# Altium schematic sheet MIPI CSI 0 and 1 Connectors.SchDoc
size 420 x 297 mm; SheetNumber: 21; SheetTotal: 26
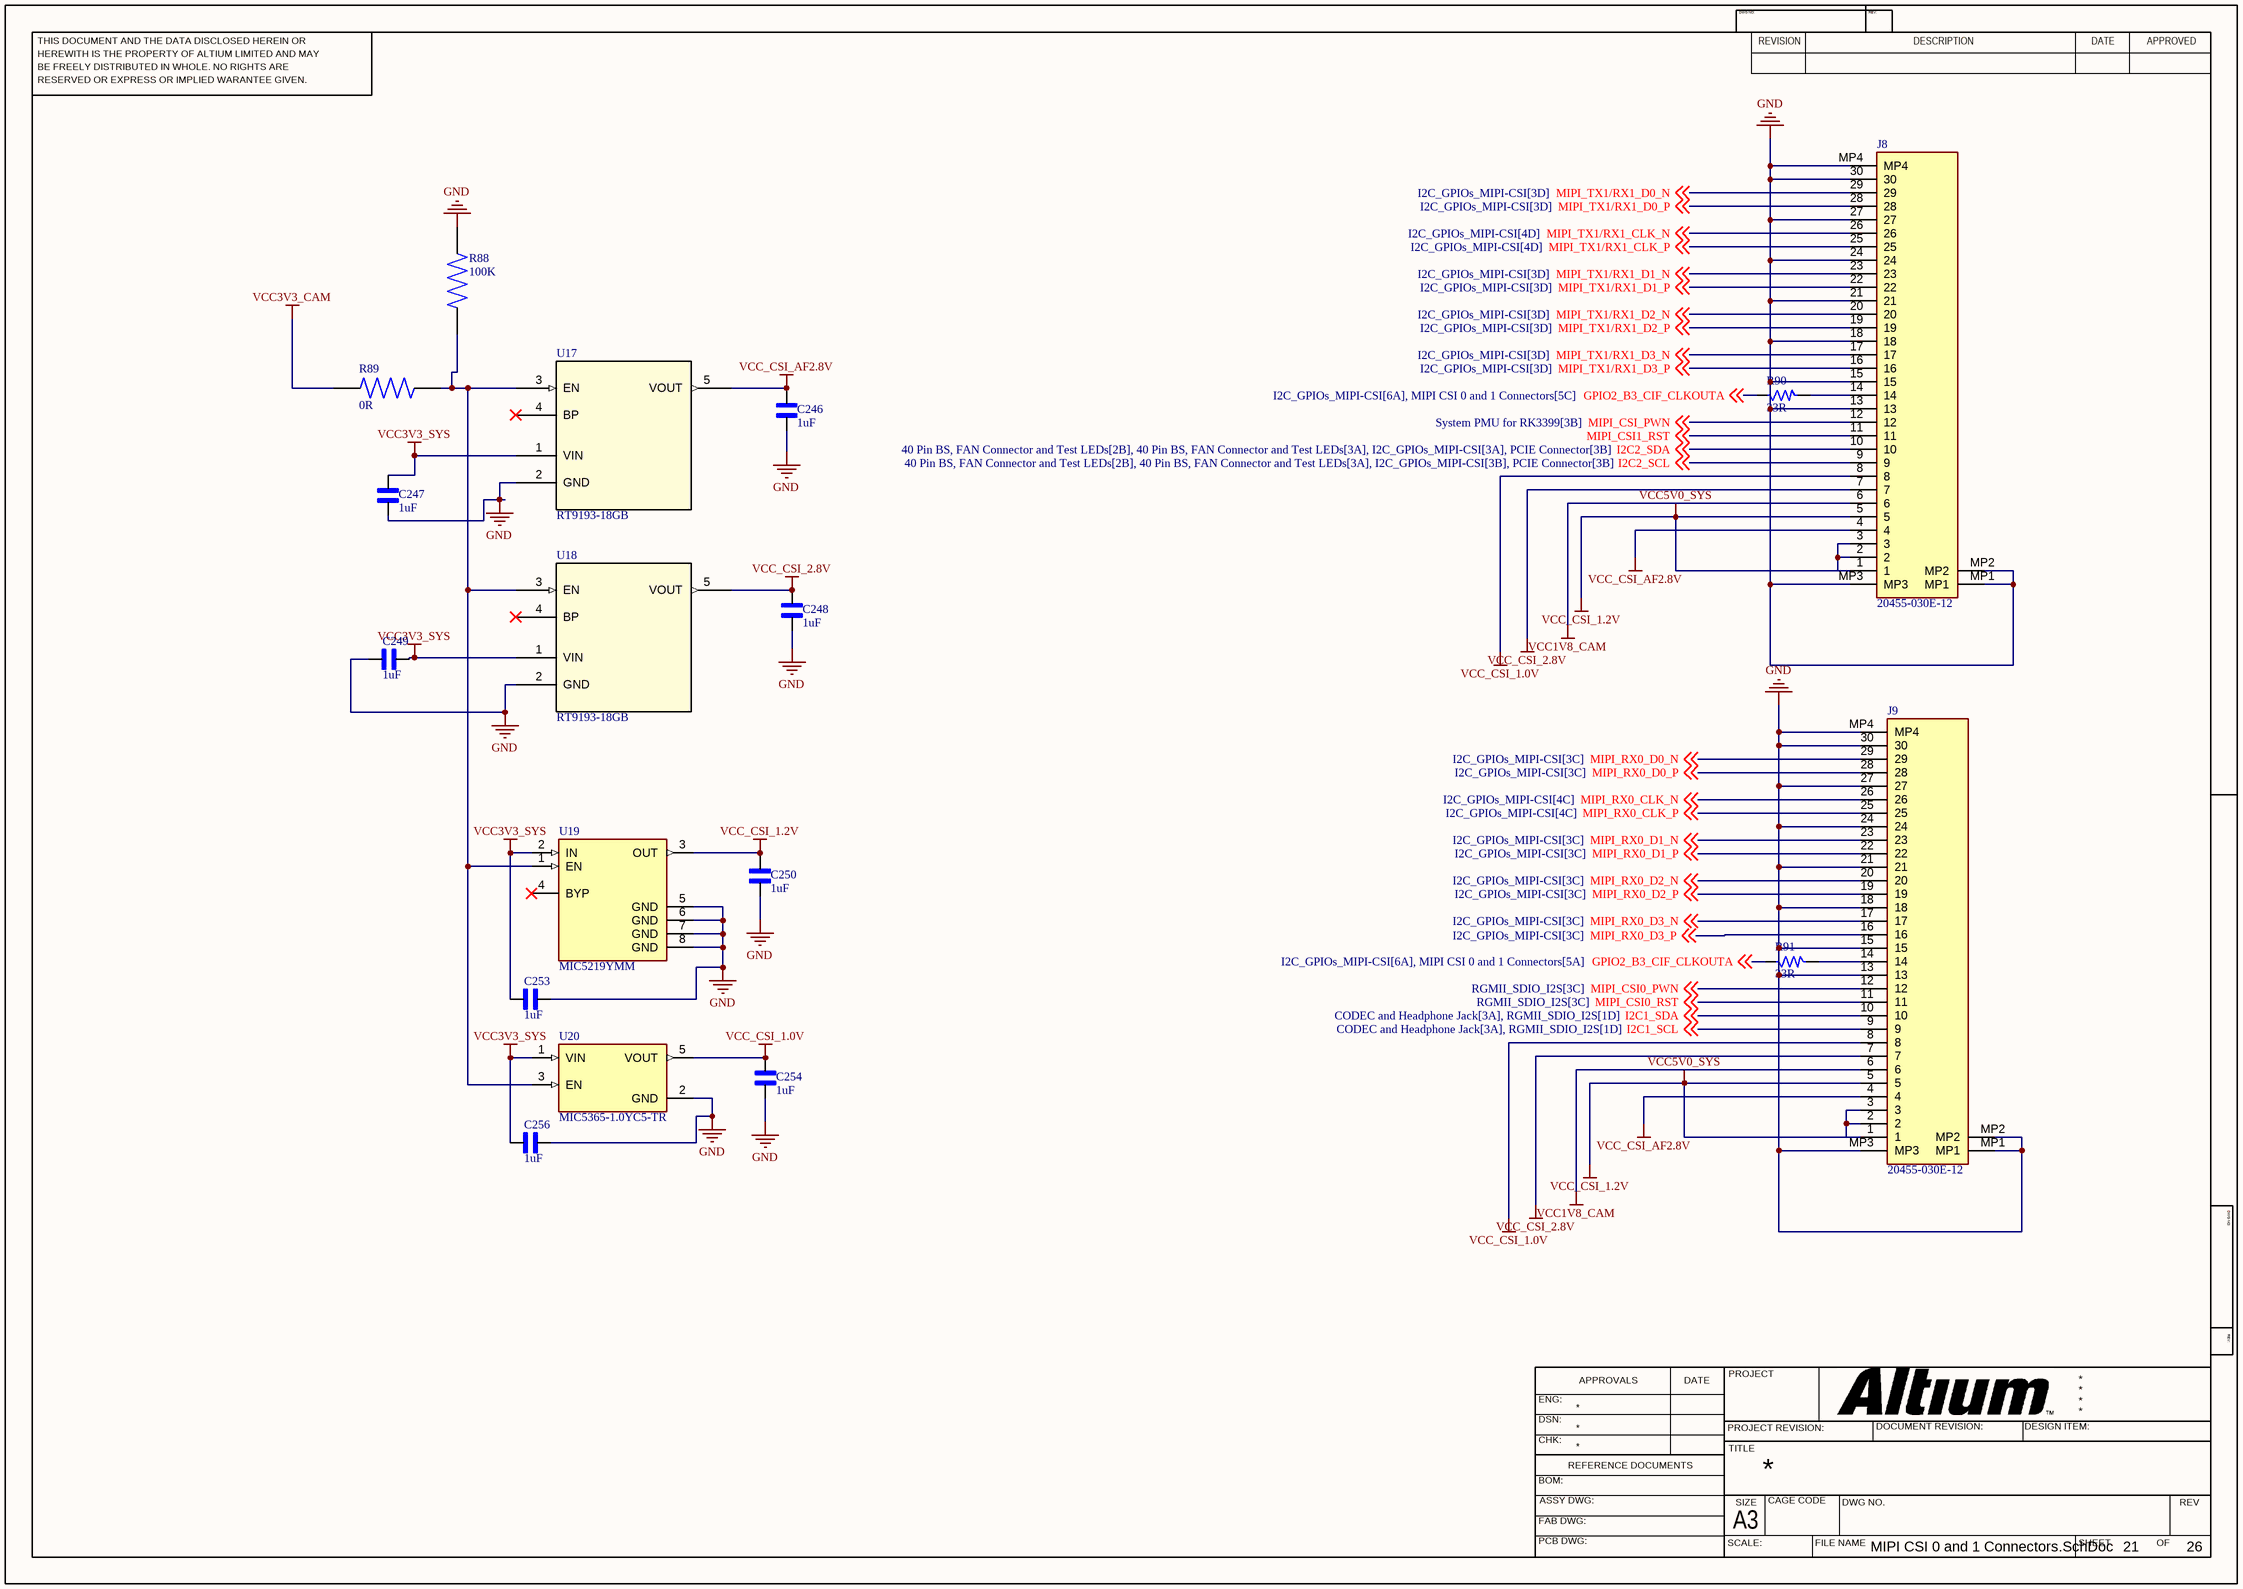
[diagram p0: MIPI CSI 0 and 1 Connectors.SchDoc]

## Parts
C246  1uF  [CAPC1005X56N]
C247  1uF  [CAPC1005X56N]
C248  1uF  [CAPC1005X56N]
C249  1uF  [CAPC1005X56N]
C250  1uF  [CAPC1005X56N]
C253  1uF  [CAPC1005X56N]
C254  1uF  [CAPC1005X56N]
C256  1uF  [CAPC1005X56N]
J8  20455-030E-12  [20455030E12]
J9  20455-030E-12  [20455030E12]
R88  100K  [RES_ERA3ARB103V]
R89  0R  [RES_ERJH6G0R00V]
R90  33R  [RESC1608X50N]
R91  33R  [RESC1608X50N]
U17  RT9193-18GB  [SOT-23-5_RIT]
U18  RT9193-18GB  [SOT-23-5_RIT]
U19  MIC5219YMM  [SOP65P490X110-8N]
U20  MIC5365-1.0YC5-TR  [SOT65P210X110-5N]

## Nets
GND: C246.1 C247.1 C248.1 C249.2 C250.1 C253.1 C254.1 C256.1 J8.13 J8.15 J8.18 J8.21 J8.24 J8.27 J8.30 J8.MP1 J8.MP2 J8.MP3 J8.MP4 J9.13 J9.15 J9.18 J9.21 J9.24 J9.27 J9.30 J9.MP1 J9.MP2 J9.MP3 J9.MP4 R88.2 U17.2(GND) U18.2(GND) U19.5(GND) U19.6(GND) U19.7(GND) U19.8(GND) U20.2(GND)
VCC1V8_CAM: J8.6 J9.6
VCC3V3_CAM: R89.1
VCC3V3_SYS: C247.2 C249.1 C253.2 C256.2 U17.1(VIN) U18.1(VIN) U19.2(IN) U20.1(VIN)
VCC5V0_SYS: C250.2 J8.1 J8.2 J8.3 J8.5 J9.1 J9.2 J9.3 J9.5 U19.3(OUT)  [also labelled VCC_CSI_1.2V]
VCC_CSI_1.0V: C254.2 J8.8 J9.8 U20.5(VOUT)
VCC_CSI_2.8V: C248.2 J8.7 J9.7 U18.5(VOUT)
VCC_CSI_AF2.8V: C246.2 J8.4 J9.4 U17.5(VOUT)
GPIO2_B3_CIF_CLKOUTA: R90.1 R91.1 ; off-sheet GPIO2_B3_CIF_CLKOUTA
I2C1_SCL: J9.9 ; off-sheet I2C1_SCL
I2C1_SDA: J9.10 ; off-sheet I2C1_SDA
I2C2_SCL: J8.9 ; off-sheet I2C2_SCL
I2C2_SDA: J8.10 ; off-sheet I2C2_SDA
MIPI_CSI0_PWN: J9.12 ; off-sheet MIPI_CSI0_PWN
MIPI_CSI0_RST: J9.11 ; off-sheet MIPI_CSI0_RST
MIPI_CSI1_RST: J8.11 ; off-sheet MIPI_CSI1_RST
MIPI_CSI_PWN: J8.12 ; off-sheet MIPI_CSI_PWN
MIPI_RX0_CLK_N: J9.26 ; off-sheet MIPI_RX0_CLK_N
MIPI_RX0_CLK_P: J9.25 ; off-sheet MIPI_RX0_CLK_P
MIPI_RX0_D0_N: J9.29 ; off-sheet MIPI_RX0_D0_N
MIPI_RX0_D0_P: J9.28 ; off-sheet MIPI_RX0_D0_P
MIPI_RX0_D1_N: J9.23 ; off-sheet MIPI_RX0_D1_N
MIPI_RX0_D1_P: J9.22 ; off-sheet MIPI_RX0_D1_P
MIPI_RX0_D2_N: J9.20 ; off-sheet MIPI_RX0_D2_N
MIPI_RX0_D2_P: J9.19 ; off-sheet MIPI_RX0_D2_P
MIPI_RX0_D3_N: J9.17 ; off-sheet MIPI_RX0_D3_N
MIPI_RX0_D3_P: J9.16 ; off-sheet MIPI_RX0_D3_P
MIPI_TX1/RX1_CLK_N: J8.26 ; off-sheet MIPI_TX1/RX1_CLK_N
MIPI_TX1/RX1_CLK_P: J8.25 ; off-sheet MIPI_TX1/RX1_CLK_P
MIPI_TX1/RX1_D0_N: J8.29 ; off-sheet MIPI_TX1/RX1_D0_N
MIPI_TX1/RX1_D0_P: J8.28 ; off-sheet MIPI_TX1/RX1_D0_P
MIPI_TX1/RX1_D1_N: J8.23 ; off-sheet MIPI_TX1/RX1_D1_N
MIPI_TX1/RX1_D1_P: J8.22 ; off-sheet MIPI_TX1/RX1_D1_P
MIPI_TX1/RX1_D2_N: J8.20 ; off-sheet MIPI_TX1/RX1_D2_N
MIPI_TX1/RX1_D2_P: J8.19 ; off-sheet MIPI_TX1/RX1_D2_P
MIPI_TX1/RX1_D3_N: J8.17 ; off-sheet MIPI_TX1/RX1_D3_N
MIPI_TX1/RX1_D3_P: J8.16 ; off-sheet MIPI_TX1/RX1_D3_P
NetJ8_14: J8.14 R90.2
NetJ9_14: J9.14 R91.2
NetR88_1: R88.1 R89.2 U17.3(EN) U18.3(EN) U19.1(EN) U20.3(EN)

Not connected (* = marked no-connect by the designer): U17 4(BP)*; U18 4(BP)*; U19 4(BYP)*

## Notes on the sheet
- THIS DOCUMENT AND THE DATA DISCLOSED HEREIN OR
- HEREWITH IS THE PROPERTY OF ALTIUM LIMITED AND MAY
- DWG NO:
- REVISION
- REV:
- DESCRIPTION
- DATE
- APPROVED
- BE FREELY DISTRIBUTED IN WHOLE. NO RIGHTS ARE
- RESERVED OR EXPRESS OR IMPLIED WARANTEE GIVEN.
- ENG:
- APPROVALS
- PROJECT
- DSN:
- CHK:
- REFERENCE DOCUMENTS
- PROJECT REVISION:
- TITLE
- DOCUMENT REVISION:
- DESIGN ITEM:
- BOM:
- FAB DWG:
- PCB DWG:
- ASSY DWG:
- SCALE:
- A3
- SIZE
- CAGE CODE
- FILE NAME
- DWG NO.
- SHEET
- OF
- REV

## Library data of the parts
C246-C250 C253 C254 C256 = 0402ZD105KAT4A: 1 ÂµF Â±10% 10V Ceramic Capacitor X5R 0402 (1005 Metric); MF: AVX; SnapEDA_Link: https://www.snapeda.com/parts/0402ZD105KAT4A/AVX/view-part/?ref=snap; Package: 1005 AVX; Value: *; MP: 0402ZD105KAT4A; Check_prices: https://www.snapeda.com/parts/0402ZD105KAT4A/AVX/view-part/?ref=eda
J8 J9 = 20455-030E-12: Board Connector, 30 Contact(s), 1 Row(s), Female, Right Angle, Surface Mount Terminal, Receptacle; Manufacturer_Name: I-Pex; Geometry.Height: 1.1mm; Manufacturer_Part_Number: 20455-030E-12; Mouser Part Number: *; Mouser Price/Stock: *; Arrow Part Number: *; Arrow Price/Stock: *; Datasheet Link: https://www.datasheet5.com/part/20455-030E-12/I-PEX%20Co%20Ltd
R88 = ERA3ARB103V: MP: ERA3ARB103V; Availability: Unavailable; Package: None; Value: *; Price: None
R89 = ERJH6G0R00V: MP: ERJH6G0R00V; Value: *; Availability: Unavailable; Price: None; Package: None
R90 R91 = RES_33R-0.1W-1%-0402: 33 Ohms ±1% 0.1W, 1/10W Chip Resistor 0402 (1005 Metric) Automotive AEC-Q200 Thick Film; Manufacturer: Panasonic Electronic Components; Manufacturer Part Number: ERJ-2RKF33R0X; Case/Package: 0402; Supplier-1: Digikey
U17 U18 = RT9193-18GB: Description; Manufacturer_Name: Richtek Technology; Copyright: Copyright (C) 2026 Ultra Librarian. All rights reserved.; Manufacturer_Part_Number: RT9193-18GB; RefDes: RefDes; Type: Type
U19 = MIC5219YMM: MIC5219 Series 500 mA ADJ Output Voltage Surface Mount LDO Regulator - MSOP-8; MF: Microchip; SnapEDA_Link: https://www.snapeda.com/parts/MIC5219YMM/Microchip+Technology/view-part/?ref=snap; Package: MSOP-8 Microchip; Value: *; MP: MIC5219YMM; Check_prices: https://www.snapeda.com/parts/MIC5219YMM/Microchip+Technology/view-part/?ref=eda
U20 = MIC5365-1.0YC5-TR: Linear Voltage Regulator IC Positive Fixed 1 Output 150mA SC-70-5; MF: Microchip; SnapEDA_Link: https://www.snapeda.com/parts/MIC5365-1.0YC5-TR/Microchip+Technology/view-part/?ref=snap; Package: SC-70-5 Microchip; Value: *; MP: MIC5365-1.0YC5-TR; Check_prices: https://www.snapeda.com/parts/MIC5365-1.0YC5-TR/Microchip+Technology/view-part/?ref=eda